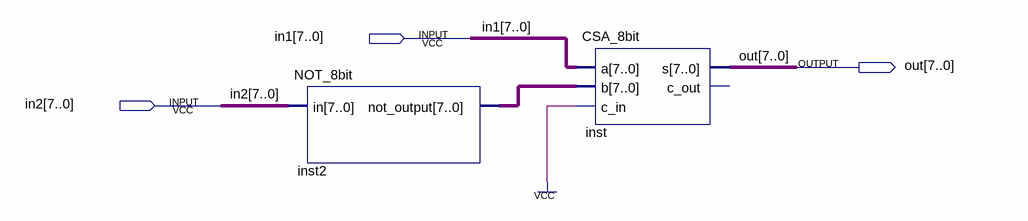
[diagram p0: schematic sheet]
// Quartus schematic Sub_8bit.bdf as structural Verilog: 2 symbols, 3 pins
module Sub_8bit (
  input  [7:0] in1,
  input  [7:0] in2,
  output [7:0] out
);

  wire [7:0] inst2_not_output;

  NOT_8bit inst2 (.in(in2), .not_output(inst2_not_output));
  CSA_8bit inst (.a(in1), .b(inst2_not_output), .c_in(1'b1), .s(out));  // open: c_out
endmodule
